# EAGLE design STl-Link-V02a (EAGLE 6.3)
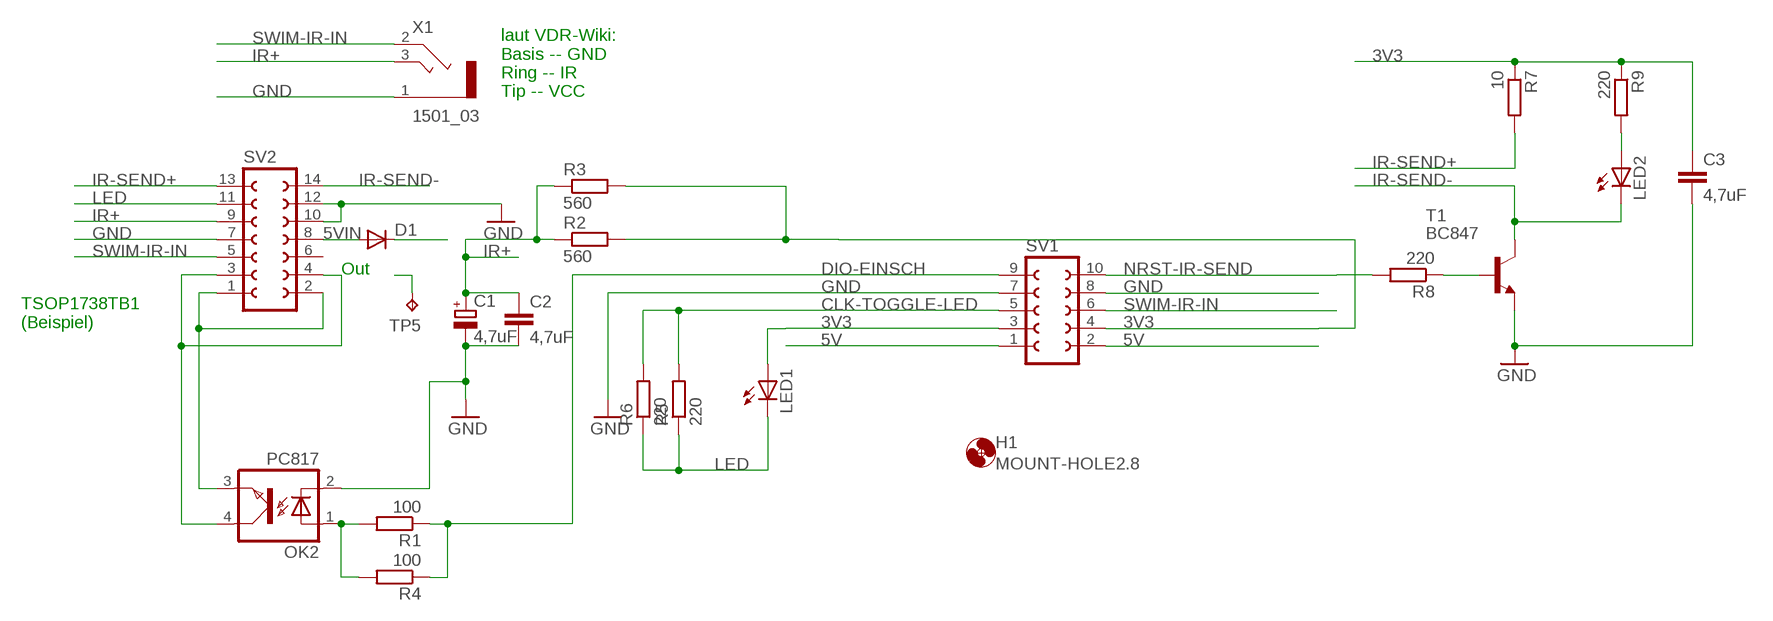
[diagram p0: schematic, sheet 1]

## Parts
C1  4,7uF  CPOL-EUE1.8-4  [E1,8-4]
C2  4,7uF  C-EUC1206K  [C1206K]
C3  4,7uF  C-EUC1206K  [C1206K]
D1  DIODE-SOD123  [SOD123]
H1  MOUNT-HOLE2.8  [2,8]
LED1  LEDCHIPLED_1206  [CHIPLED_1206]
LED2  LEDCHIPLED_1206  [CHIPLED_1206]
OK2  PC817  [DIL04]
R1  100  R-EU_0204/7  [0204/7]
R2  560  R-EU_0204/7  [0204/7]
R3  560  R-EU_R0805W  [R0805W]
R4  100  R-EU_R0805W  [R0805W]
R5  220  R-EU_0204/7  [0204/7]
R6  220  R-EU_R0805W  [R0805W]
R7  10  R-EU_R0805W  [R0805W]
R8  220  R-EU_R0805W  [R0805W]
R9  220  R-EU_R0805W  [R0805W]
SV1  FE05-2  [FE05-2]
SV2  FE07-2W  [FE07-2W]
T1  BC847  [SOT23]
TP5  TPB1,27  [B1,27]
X1  1501_03  [1501_03]

## Nets
3V3: C3.1 LED1.A R2.2 R3.2 R7.1 R9.1 SV1.3 SV1.4
5V: D1.C SV1.1 SV1.2
5VIN: D1.A SV2.8
CLK-TOGGLE-LED: R5.2 R6.2 SV1.5
DIO-EINSCH: R1.1 R4.1 SV1.9
GND: C1.- C2.2 C3.2 OK2.2(C) SV1.7 SV1.8 SV2.7 SV2.10 SV2.12 T1.2(E) X1.1
IR+: C1.+ C2.1 R2.1 R3.1 SV2.9 X1.3
IR-SEND+: R7.2 SV2.13
IR-SEND-: LED2.C SV2.14 T1.3(C)
LED: LED1.C R5.1 R6.1 SV2.11
N$1: LED2.A R9.2
N$2: OK2.1(A) R1.2 R4.2
N$3: R8.1 T1.1(B)
N$4: OK2.3(EMIT) SV2.1 SV2.2
NRST-IR-SEND: R8.2 SV1.10
OK2: OK2.4(COL) SV2.3 SV2.4
SWIM-IR-IN: SV1.6 SV2.5 TP5.TP X1.2
Unconnected: SV2.6

## Notes on the sheet
- laut VDR-Wiki:
  Basis -- GND
  Ring -- IR
  Tip -- VCC
- Out
- TSOP1738TB1
  (Beispiel)

## Library data of the parts
C1 = rcl:CPOL-EU: POLARIZED CAPACITOR, European symbol
C2 C3 = rcl:C-EU: CAPACITOR, European symbol
D1 = diode:DIODE-: DIODE
H1 = holes:MOUNT-HOLE: MOUNTING HOLE with drill center marker
LED1 LED2 = led:LED: LED OSRAM: - CHIPLED LG R971, LG N971, LY N971, LG Q971, LY Q971, LO R971, LY R971 LH N974, LH R974 LS Q976, LO Q976, LY Q976 LO Q996 - Hyper CHIPLED LW Q18S LB Q993, LB Q99A, LB R99A - SideLED LS A670, LO A670, LY A670, LG A670, LP A670 LB A673, LV A673, LT A673, LW A673 LH A674 LY A675 LS A676, LA A676, LO A676, LY A676, LW A676 LS A679, LY A679, LG A679 - Hyper Micro SIDELED® LS Y876, LA Y876, LO Y876, LY Y876 LT Y87S - SmartLED LW L88C, LW L88S LB L89C, LB L89S, LG L890 LS L89K, LO L89K, LY L89K LS L896, LA L896, LO L896, LY L896 - TOPLED LS T670, LO T670, LY T670, LG T670, LP T670 LSG T670, LSP T670, LSY T670, LOP T670, LYG T670 LG T671, LOG T671, LSG T671 LB T673, LV T673, LT T673, LW T673 LH T674 LS T676, LA T676, LO T676, LY T676, LB T676, LH T676, LSB T676, LW T676 LB T67C, LV T67C, LT T67C, LS T67K, LO T67K, LY T67K, LW E67C LS E67B, LA E67B, LO E67B, LY E67B, LB E67C, LV E67C, LT E67C LW T67C LS T679, LY T679, LG T679 LS T770, LO T770, LY T770, LG T770, LP T770 LB T773, LV T773, LT T773, LW T773 LH T774 LS E675, LA E675, LY E675, LS T675 LS T776, LA T776, LO T776, LY T776, LB T776 LHGB T686 LT T68C, LB T68C - Hyper Mini TOPLED® LB M676 - Mini TOPLED Santana® LG M470 LS M47K, LO M47K, LY M47K Source: http://www.osram.convergy.de LUXEON: - LUMILED® LXK2-PW12-R00, LXK2-PW12-S00, LXK2-PW14-U00, LXK2-PW14-V00 LXK2-PM12-R00, LXK2-PM12-S00, LXK2-PM14-U00 LXK2-PE12-Q00, LXK2-PE12-R00, LXK2-PE12-S00, LXK2-PE14-T00, LXK2-PE14-U00 LXK2-PB12-K00, LXK2-PB12-L00, LXK2-PB12-M00, LXK2-PB14-N00, LXK2-PB14-P00, LXK2-PB14-Q00 LXK2-PR12-L00, LXK2-PR12-M00, LXK2-PR14-Q00, LXK2-PR14-R00 LXK2-PD12-Q00, LXK2-PD12-R00, LXK2-PD12-S00 LXK2-PH12-R00, LXK2-PH12-S00 LXK2-PL12-P00, LXK2-PL12-Q00, LXK2-PL12-R00 Source: www.luxeon.com KINGBRIGHT: KA-3528ASYC Source: www.kingbright.com
OK2 = optocoupler:PC817: SHARP OPTO COUPLER; MPN: PC817X4J000F; OC_FARNELL: 9707727; OC_NEWARK: 97K7059
R1-R9 = rcl:R-EU_: RESISTOR, European symbol
SV1 = con-lsta:FE05-2: FEMALE HEADER; OC_FARNELL: unknown; OC_NEWARK: unknown
SV2 = con-lsta:FE07-2W: FEMALE HEADER; OC_FARNELL: unknown; OC_NEWARK: unknown
T1 = transistor:BC847: NPN TRANSISTOR
TP5 = testpad:TP: Test pad
X1 = con-lumberg:1501_03: Klinkensteckverbinder nach JISC 6560, 2,5 mm Jack connectors according to JISC 6560, 2.5 mm Source: http://www.lumberg.com/Produkte/PDFs/1501_03.pdf; OC_FARNELL: 1200127; OC_NEWARK: unknown

## Net classes
0 default: width 0.406 mm

## Board
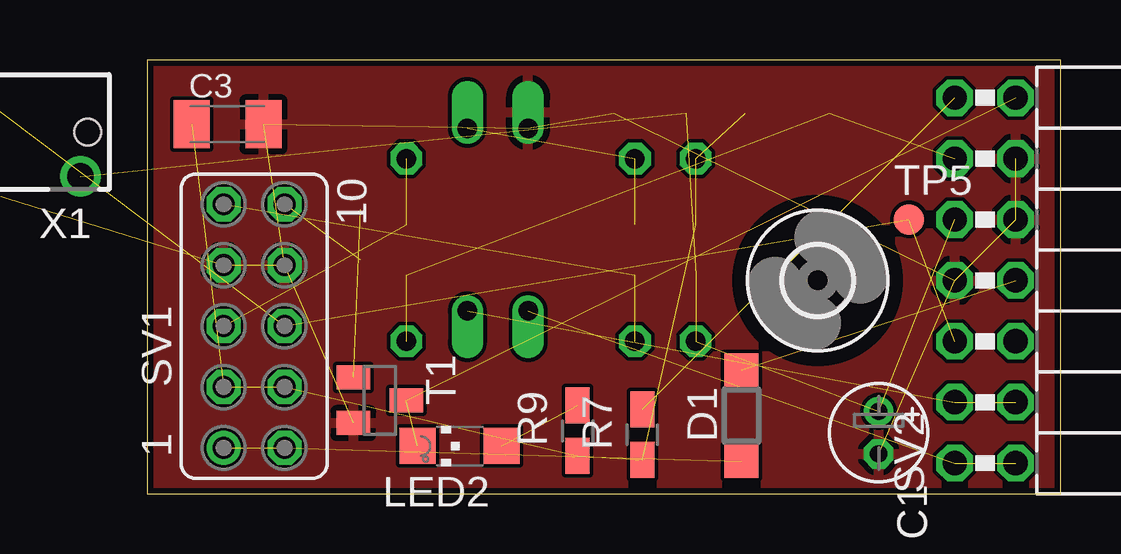
[diagram p1: board, top side]
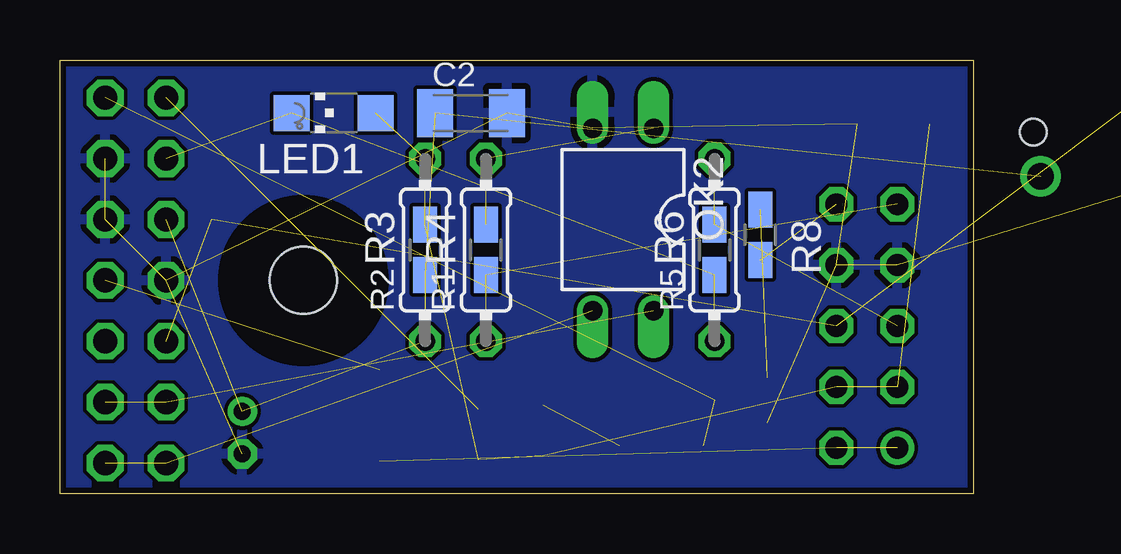
[diagram p2: board, bottom side, seen from below]

Size 38.08 x 18.09 mm. Coordinates in mm from the lower left corner, seen from the top.
Outline: 0,0 38.08,0 38.08,18.09 0,18.09 0,0
Copper layers (1*16): Top 0.035mm / dielectric 1.5mm / Bottom 0.035mm
Design rules "Fusion_eagle_rule_v1.1": minimum track width 6mil, minimum drill 12mil, track to track 6mil, track to pad 6mil, pad to pad 6mil, via to via 6mil, smd to smd 0mil, copper to edge 10mil, drill to drill 10mil, minimum pad ring 10mil, minimum via ring 6mil, stop-mask expansion 2mil, vias tented up to drill 100mil, thermal gap 10mil

### Footprints (pad centres in the part's own frame; a part is rotated, then mirrored left to right if it is on the bottom)
E1,8-4 = drill 0.711 pad 1.168: + -0.889,0 | drill 0.711 pad 1.168 octagon: - 0.889,0
C1206K = smd 1.5 x 2: 1 -1.5,0; 2 1.5,0
SOD123 = smd 1.4 x 1.4: A 1.9,0; C -1.9,0
2,8 = hole 2.8: 0,0
CHIPLED_1206 = smd 1.5 x 1.5: A 0,-1.75; C 0,1.75
DIL04 = drill 0.813 offset: 1 -1.27,-3.81; 2 1.27,-3.81; 3 1.27,3.81; 4 -1.27,3.81
0204/7 = drill 0.813 octagon: 1 -3.81,0; 2 3.81,0
R0805W = smd 1.5 x 1: 1 -1.052,0; 2 1.052,0
FE05-2 = drill 0.914: 1 -5.08,1.27 | drill 0.914 octagon: 2 -5.08,-1.27; 3 -2.54,1.27; 4 -2.54,-1.27; 5 0,1.27; 6 0,-1.27; 7 2.54,1.27; 8 2.54,-1.27; 9 5.08,1.27; 10 5.08,-1.27
FE07-2W = drill 1.016 octagon: 1 -7.62,1.27; 2 -7.62,-1.27; 3 -5.08,1.27; 4 -5.08,-1.27; 5 -2.54,1.27; 6 -2.54,-1.27; 7 0,1.27; 8 0,-1.27; 9 2.54,1.27; 10 2.54,-1.27; 11 5.08,1.27; 12 5.08,-1.27; 13 7.62,1.27; 14 7.62,-1.27
SOT23 = smd 1 x 1.4: 1 -0.95,-1.1; 2 0.95,-1.1; 3 0,1.1
B1,27 = smd 1.27 x 1.27: TP 0,0
1501_03 = drill 1.1 pad 1.7: 1 -1.85,0.3; 2 1.85,-1; 3 -1.85,-5.7 | hole 1.1: 0,0; 0,-6

### Placement (x,y rotation side)
C1  30.48,2.54 270 top
C2  20.95,15.88 0 bottom
C3  3.33,15.4 0 top
D1  24.76,3.25 90 top
H1  27.94,8.89 0 top
LED1  26.67,15.88 90 bottom
LED2  13.02,1.99 90 top
OK2  14.61,11.43 180 bottom
R1  20.32,10.16 90 bottom
R2  22.86,10.16 90 bottom
R3  22.86,10.16 90 bottom
R4  20.32,10.16 90 bottom
R5  10.79,10.16 90 bottom
R6  10.79,10.16 90 bottom
R7  20.64,2.46 90 top
R8  8.89,10.79 270 bottom
R9  17.93,2.62 90 top
SV1  4.45,6.99 90 top
SV2  34.92,8.89 90 top
T1  9.69,3.89 270 top
TP5  31.75,11.43 0 top
X1  -8.49,15.08 90 top

### Tracks (layer width: path | path; a pad name or v marks a point on that pad's centre or on a via)
3V3  (7 unrouted)
5V  (2 unrouted)
5VIN  (1 unrouted)
CLK-TOGGLE-LED  (2 unrouted)
DIO-EINSCH  (2 unrouted)
GND  (10 unrouted)
  pour Top: 0,17.78 0,0 36.83,0 38.1,0 38.1,17.78
  pour Bottom: 0,0 38.1,0 38.1,17.78 0,17.78
IR+  (5 unrouted)
IR-SEND+  (1 unrouted)
IR-SEND-  (2 unrouted)
LED  (3 unrouted)
N$1  (1 unrouted)
N$2  (2 unrouted)
N$3  (1 unrouted)
N$4  (2 unrouted)
NRST-IR-SEND  (1 unrouted)
OK2  (2 unrouted)
SWIM-IR-IN  (3 unrouted)